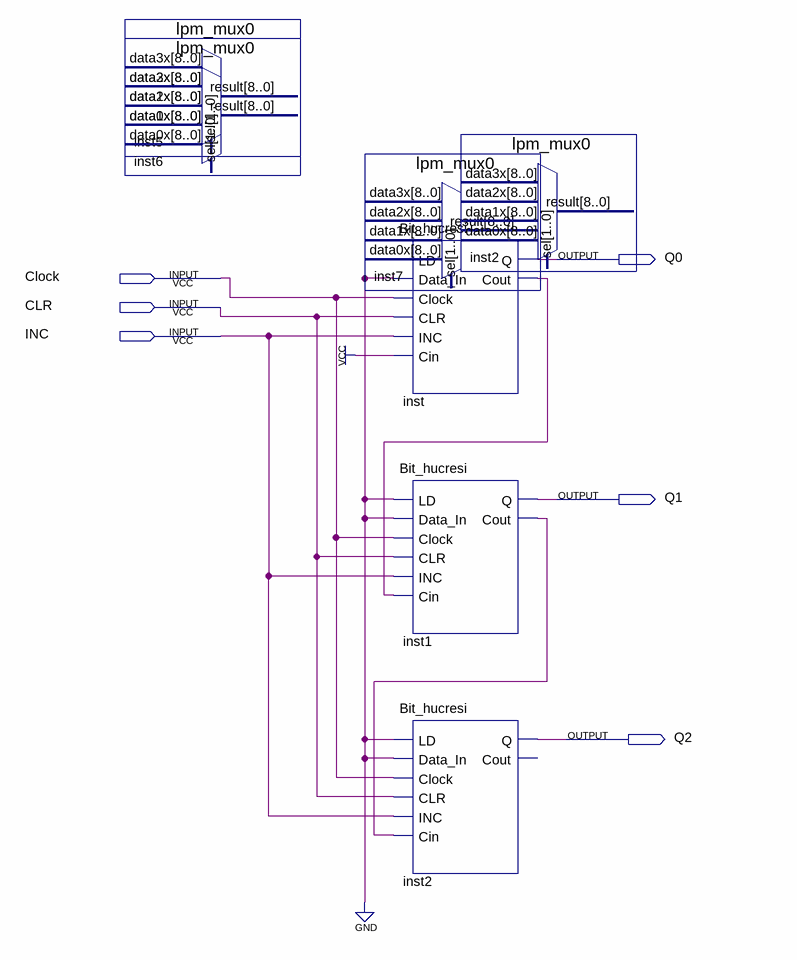
[diagram p0: schematic sheet]
// Quartus schematic Register_3bit.bdf as structural Verilog: 7 symbols, 6 pins
module Register_3bit (
  input  Clock,
  input  CLR,
  input  INC,
  output Q0,
  output Q1,
  output Q2
);

  wire inst1_cout, inst_cout;
  wire [8:0] undriven, undriven_2, undriven_3;

  lpm_mux0 inst5 (.data2x(undriven), .data1x(undriven_2), .data0x(undriven_3));  // open: data3x, sel, result
  lpm_mux0 inst6 (.data3x(undriven), .data2x(undriven_2), .data1x(undriven_3));  // open: data0x, sel, result
  lpm_mux0 inst7 (.data0x({9{1'b0}}));  // open: data3x, data2x, data1x, sel, result
  Bit_hucresi inst (
    .LD(1'b0), .Data_In(1'b0), .Clock(Clock), .CLR(CLR), .INC(INC), .Cin(1'b1), .Q(Q0), .Cout(inst_cout));
  Bit_hucresi inst1 (
    .LD(1'b0), .Data_In(1'b0), .Clock(Clock), .CLR(CLR), .INC(INC), .Cin(inst_cout), .Q(Q1), .Cout(inst1_cout));
  Bit_hucresi inst2 (
    .LD(1'b0), .Data_In(1'b0), .Clock(Clock), .CLR(CLR), .INC(INC), .Cin(inst1_cout), .Q(Q2));  // open: Cout
  lpm_mux0 inst2_dup2 ();  // open: data3x, data2x, data1x, data0x, sel, result
endmodule
